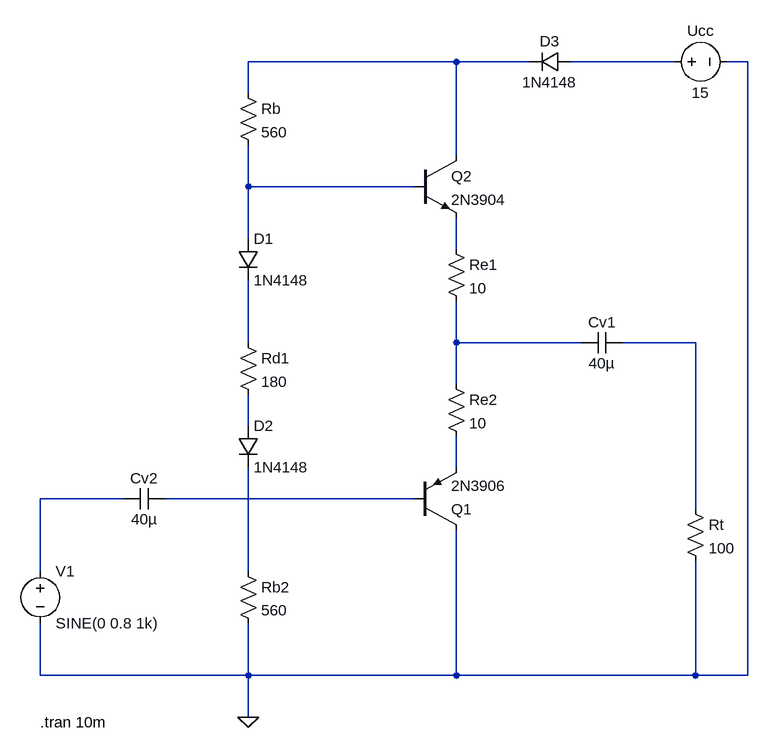
[diagram p0: schematic Draft2.asc]
Draft2.asc, the LTspice schematic file:
Version 4.1
SHEET 1 1172 680
WIRE 720 -624 400 -624
WIRE 832 -624 720 -624
WIRE 1056 -624 896 -624
WIRE 1168 -624 1136 -624
WIRE 400 -576 400 -624
WIRE 720 -480 720 -624
WIRE 400 -432 400 -496
WIRE 656 -432 400 -432
WIRE 400 -352 400 -432
WIRE 720 -336 720 -384
WIRE 400 -192 400 -288
WIRE 720 -192 720 -256
WIRE 912 -192 720 -192
WIRE 1088 -192 976 -192
WIRE 720 -128 720 -192
WIRE 400 -64 400 -112
WIRE 720 0 720 -48
WIRE 208 48 80 48
WIRE 656 48 272 48
WIRE 1088 64 1088 -192
WIRE 80 160 80 48
WIRE 400 160 400 0
WIRE 80 320 80 240
WIRE 400 320 400 240
WIRE 400 320 80 320
WIRE 720 320 720 96
WIRE 720 320 400 320
WIRE 1088 320 1088 144
WIRE 1088 320 720 320
WIRE 1168 320 1168 -624
WIRE 1168 320 1088 320
WIRE 400 384 400 320
FLAG 400 384 0
SYMBOL voltage 80 144 R0
WINDOW 123 0 0 Left 0
WINDOW 39 0 0 Left 0
SYMATTR InstName V1
SYMATTR Value SINE(0 0.8 1k)
SYMBOL cap 272 32 R90
WINDOW 0 0 32 VBottom 2
WINDOW 3 32 32 VTop 2
SYMATTR InstName Cv2
SYMATTR Value 40µ
SYMBOL res 384 144 R0
SYMATTR InstName Rb2
SYMATTR Value 560
SYMBOL res 384 -208 R0
SYMATTR InstName Rd1
SYMATTR Value 180
SYMBOL res 384 -592 R0
SYMATTR InstName Rb
SYMATTR Value 560
SYMBOL res 704 -352 R0
SYMATTR InstName Re1
SYMATTR Value 10
SYMBOL res 704 -144 R0
SYMATTR InstName Re2
SYMATTR Value 10
SYMBOL res 1072 48 R0
SYMATTR InstName Rt
SYMATTR Value 100
SYMBOL cap 976 -208 R90
WINDOW 0 0 32 VBottom 2
WINDOW 3 32 32 VTop 2
SYMATTR InstName Cv1
SYMATTR Value 40µ
SYMBOL pnp 656 96 M180
SYMATTR InstName Q1
SYMATTR Value 2N3906
SYMBOL npn 656 -480 R0
SYMATTR InstName Q2
SYMATTR Value 2N3904
SYMBOL diode 384 -352 R0
SYMATTR InstName D1
SYMATTR Value 1N4148
SYMBOL diode 384 -64 R0
SYMATTR InstName D2
SYMATTR Value 1N4148
SYMBOL diode 896 -640 R90
WINDOW 0 0 32 VBottom 2
WINDOW 3 32 32 VTop 2
SYMATTR InstName D3
SYMATTR Value 1N4148
SYMBOL voltage 1040 -624 R270
WINDOW 0 32 56 VTop 2
WINDOW 3 -32 56 VBottom 2
WINDOW 123 0 0 Left 0
WINDOW 39 0 0 Left 0
SYMATTR InstName Ucc
SYMATTR Value 15
TEXT 80 392 Left 2 !.tran 10m

The netlist it stands for:
* Draft2.asc
V1 N010 0 SINE(0 0.8 1k)
Cv2 N011 N010 40µ
Rb2 N012 0 560
Rd1 N005 N008 180
Rb N001 N003 560
Re1 N004 N006 10
Re2 N006 N009 10
Rt N007 0 100
Cv1 N007 N006 40µ
Q1 0 N011 N009 0 2N3906
Q2 N001 N003 N004 0 2N3904
D1 N003 N005 1N4148
D2 N008 N012 1N4148
D3 N002 N001 1N4148
V§Ucc N002 0 15
.model D D
.lib standard.dio
.model NPN NPN
.model PNP PNP
.lib standard.bjt
.tran 10m
.backanno
.end